# EAGLE design snatchfreezer_rev2 (EAGLE 7.1.0)
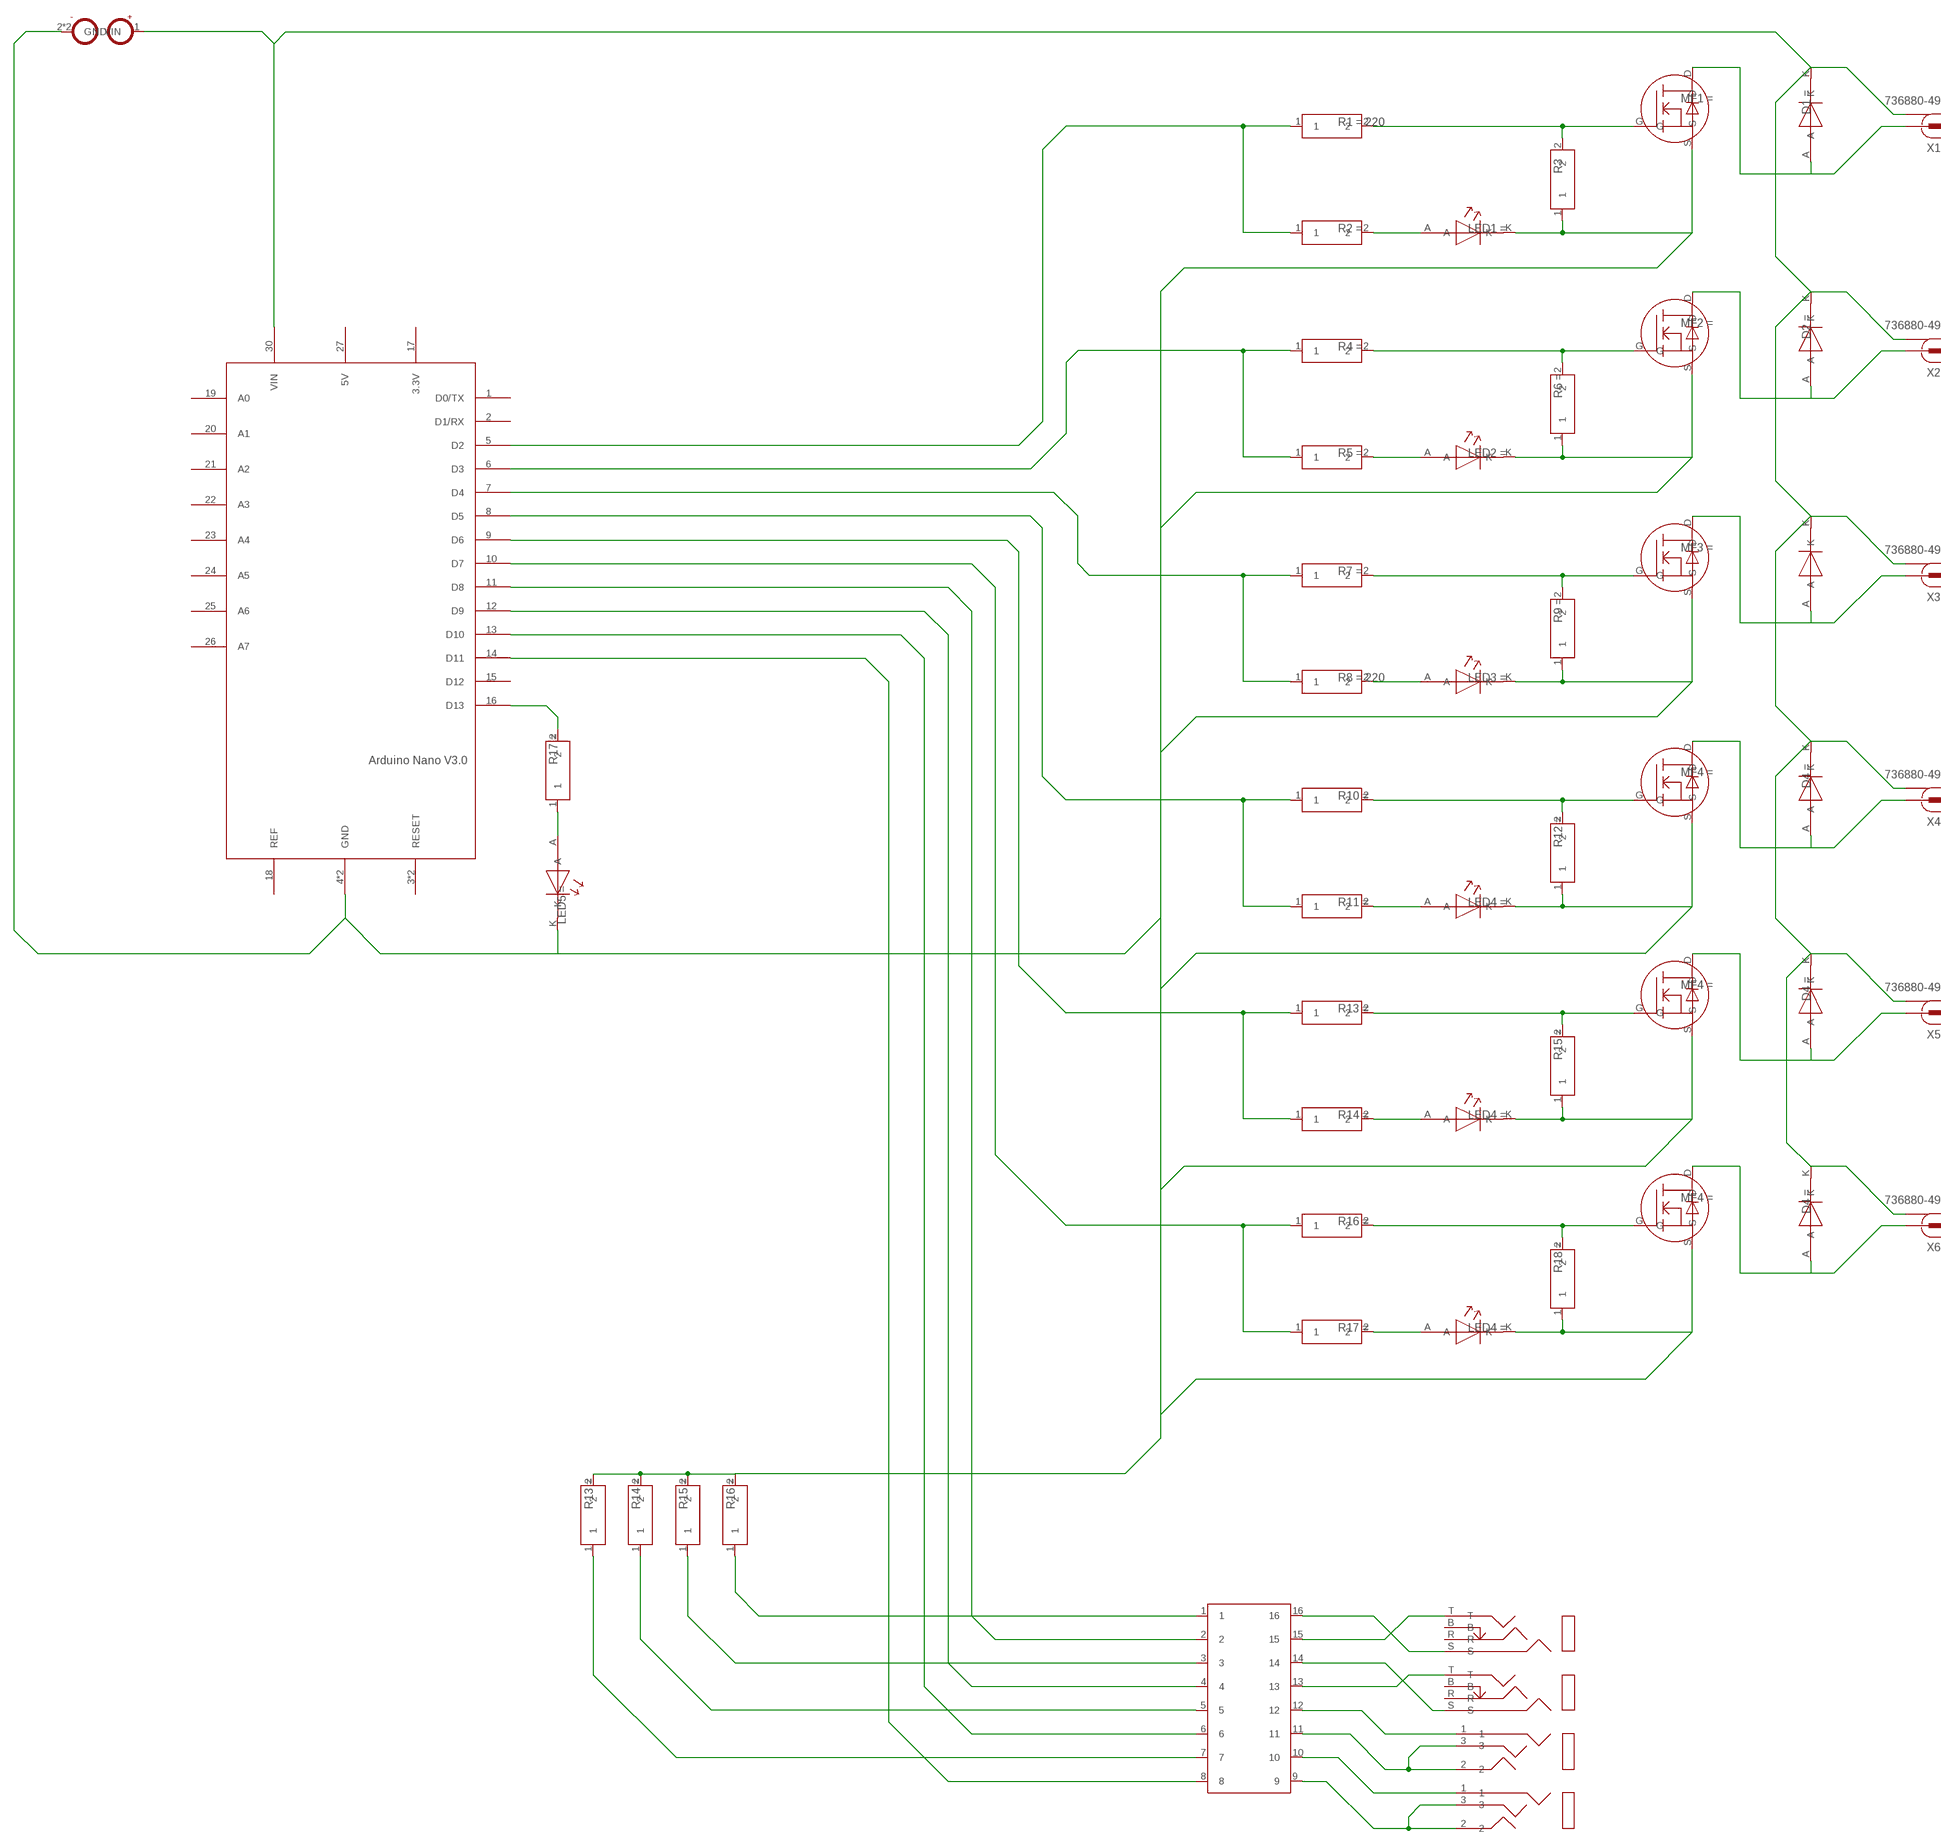
[diagram p0: schematic, sheet 1]

## Parts
R1  RESISTOR  [RESISTOR]
R2  RESISTOR  [RESISTOR]
R3  RESISTOR  [RESISTOR]
R4  RESISTOR  [RESISTOR]
R5  RESISTOR  [RESISTOR]
R6  RESISTOR  [RESISTOR]
R7  RESISTOR  [RESISTOR]
R8  RESISTOR  [RESISTOR]
R9  RESISTOR  [RESISTOR]
R10  RESISTOR  [RESISTOR]
R11  RESISTOR  [RESISTOR]
R12  RESISTOR  [RESISTOR]
R13  RESISTOR  [RESISTOR]
R14  RESISTOR  [RESISTOR]
R15  RESISTOR  [RESISTOR]
R16  RESISTOR  [RESISTOR]
R17  RESISTOR  [RESISTOR]
R18  RESISTOR  [RESISTOR]
U$1  ARDUINO_NANO30  [ARDUINO_NANO30]
U$2  IRLR8721  [IRLR8721]
U$3  IRLR8721  [IRLR8721]
U$4  IRLR8721  [IRLR8721]
U$5  LED3MM  [LED3MM]
U$6  PHONEJACK_35  [PHONEJACK_35]
U$7  PHONEJACK_35  [PHONEJACK_35]
U$8  IC-16  [IC-16]
U$9  RESISTOR  [RESISTOR]
U$10  LED3MM  [LED3MM]
U$11  LED3MM  [LED3MM]
U$12  DIODE  [DIODE]
U$13  DIODE  [DIODE]
U$14  DIODE  [DIODE]
U$16  IRLR8721  [IRLR8721]
U$17  LED3MM  [LED3MM]
U$20  IRLR8721  [IRLR8721]
U$21  DIODE  [DIODE]
U$22  LED3MM  [LED3MM]
U$23  LED3MM  [LED3MM]
U$24  DIODE  [DIODE]
U$28  IRLR8721  [IRLR8721]
U$30  RESISTOR  [RESISTOR]
U$31  LED3MM  [LED3MM]
U$32  DIODE  [DIODE]
U$36  POWER_CONNECT  [POWER_CONNECT]
U$37  RESISTOR  [RESISTOR]
U$38  RESISTOR  [RESISTOR]
U$39  RESISTOR  [RESISTOR]
U$40  PHONEJACK_25  [PHONEJACK_25]
U$41  PHONEJACK_25  [PHONEJACK_25]
X1  736880-49  [736880-49]
X2  736880-49  [736880-49]
X3  736880-49  [736880-49]
X4  736880-49  [736880-49]
X5  736880-49  [736880-49]
X6  736880-49  [736880-49]

## Nets
12V2: U$1.30(VIN) U$12.K U$13.K U$14.K U$21.K U$24.K U$32.K U$36.1(VIN) X1.GND X2.GND X3.GND X4.GND X5.GND X6.GND
GND2: R3.1 R6.1 R9.1 R12.1 R15.1 R18.1 U$1.4(GND) U$1.29(GND) U$2.S U$3.S U$4.S U$5.K U$10.K U$11.K U$16.S U$17.K U$20.S U$22.K U$23.K U$28.S U$30.2 U$31.K U$36.2(GND) U$36.3(GND) U$37.2 U$38.2 U$39.2
N$1: R1.2 R3.2 U$2.G
N$2: U$2.D U$12.A X1.SIGNAL
N$3: R2.2 U$11.A
N$4: U$7.S U$8.16
N$5: U$8.1 U$30.1
N$6: R1.1 R2.1 U$1.5(D2)
N$7: U$3.D U$13.A X2.SIGNAL
N$8: U$8.3 U$37.1
N$9: U$7.T U$8.15
N$10: R5.2 U$10.A
N$11: R4.2 R6.2 U$3.G
N$12: R4.1 R5.1 U$1.6(D3)
N$13: U$20.D U$24.A X3.SIGNAL
N$14: U$8.5 U$38.1
N$15: U$8.7 U$39.1
N$16: R8.2 U$23.A
N$17: R7.2 R9.2 U$20.G
N$18: R7.1 R8.1 U$1.7(D4)
N$19: U$28.D U$32.A X4.SIGNAL
N$20: U$1.11(D8) U$8.2
N$21: U$1.12(D9) U$8.4
N$22: R11.2 U$31.A
N$23: R10.2 R12.2 U$28.G
N$24: R10.1 R11.1 U$1.8(D5)
N$25: U$1.13(D10) U$8.6
N$26: U$1.14(D11) U$8.8
N$27: U$6.T U$8.13
N$28: U$6.S U$8.14
N$29: U$4.D U$14.A X5.SIGNAL
N$30: R14.2 U$5.A
N$31: U$8.12 U$40.1
N$32: U$8.11 U$40.2 U$40.3
N$33: U$8.10 U$41.1
N$34: U$8.9 U$41.2 U$41.3
N$35: U$1.16(D13) U$9.2
N$36: U$9.1 U$22.A
N$37: R13.2 R15.2 U$4.G
N$38: R13.1 R14.1 U$1.9(D6)
N$39: U$16.D U$21.A X6.SIGNAL
N$40: R17.2 U$17.A
N$41: R16.2 R18.2 U$16.G
N$42: R16.1 R17.1 U$1.10(D7)
Unconnected: U$1.1(D0/TX) U$1.2(D1/RX) U$1.3(RESET) U$1.15(D12) U$1.17(3.3V) U$1.18(REF) U$1.19(A0) U$1.20(A1) U$1.21(A2) U$1.22(A3) U$1.23(A4) U$1.24(A5) U$1.25(A6) U$1.26(A7) U$1.27(5V) U$1.28(RESET) U$6.B U$6.R U$7.B U$7.R

## Library data of the parts
R1 = drazil:RESISTOR; R1: 220
R2-R7 R9-R18 U$9 U$30 U$37-U$39 = drazil:RESISTOR
R8 = drazil:RESISTOR; R8: 220
U$1 = drazil:ARDUINO_NANO30
U$2-U$4 U$16 U$20 U$28 = drazil:IRLR8721
U$5 U$10 U$11 U$17 U$22 U$23 U$31 = drazil:LED3MM
U$6 U$7 = drazil:PHONEJACK_35
U$8 = drazil:IC-16
U$12-U$14 U$21 U$24 U$32 = drazil:DIODE
U$36 = drazil:POWER_CONNECT
U$40 U$41 = drazil:PHONEJACK_25
X1-X6 = drazil:736880-49: Cinch Connector ( RCA Jack ) Cinch-Einbaukupplung 90º 72345 Vernickelt BKL Electronic Source: Conrad <http://www.conrad.de/ce/de/product/736880>

## Board
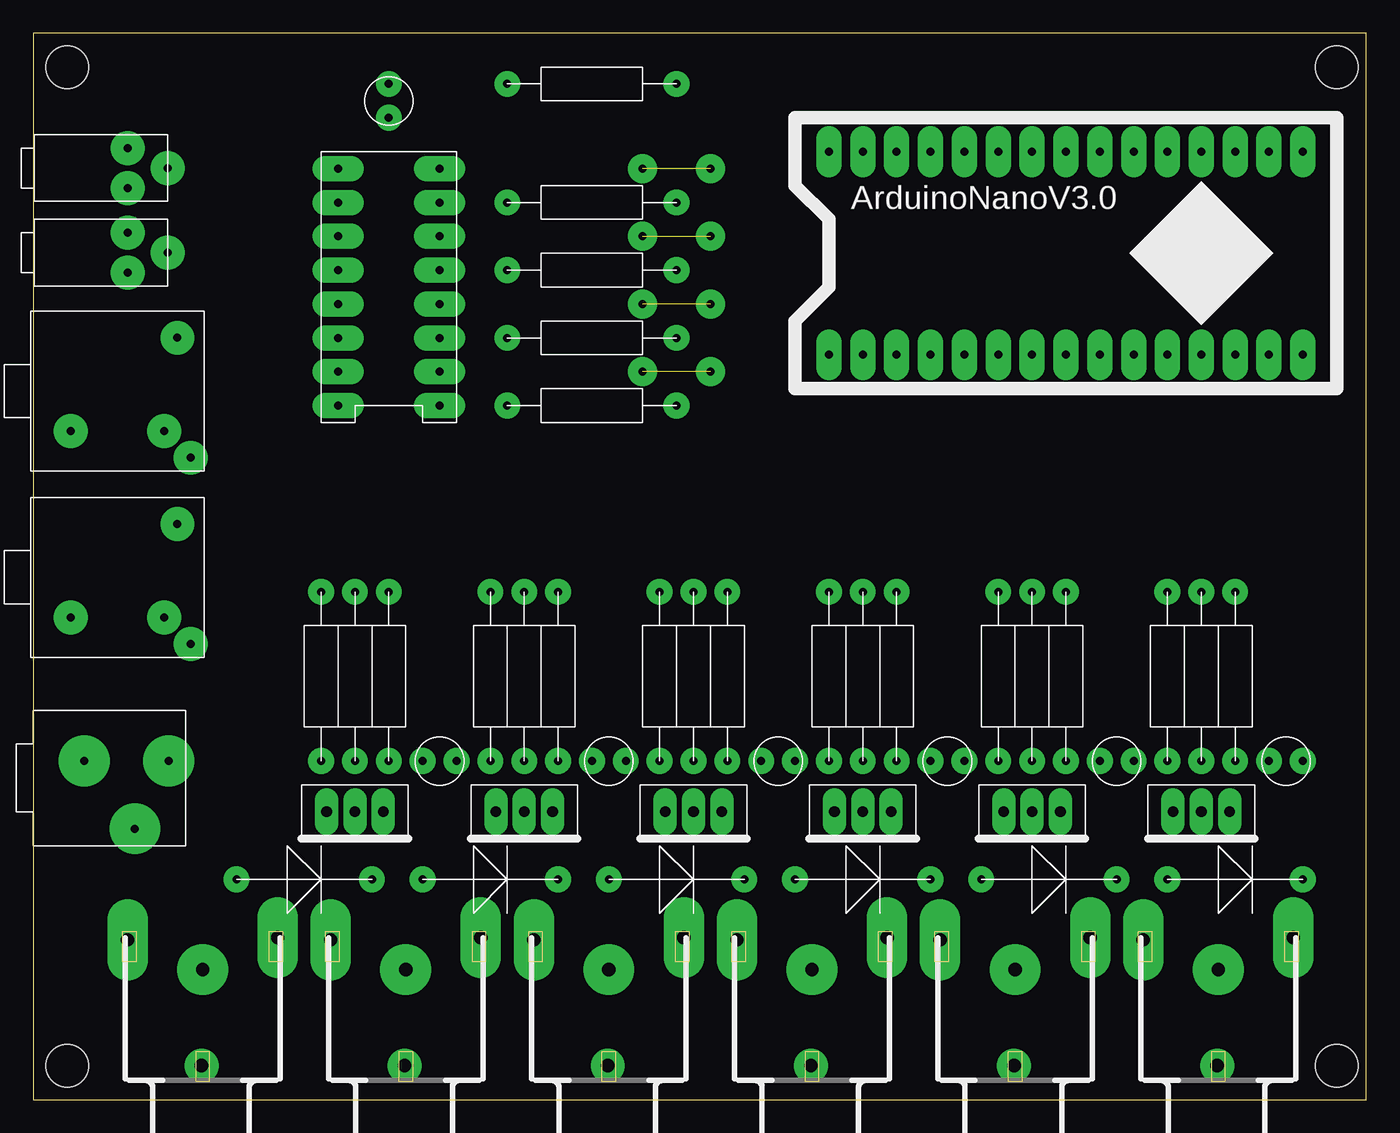
[diagram p1: board, top side]
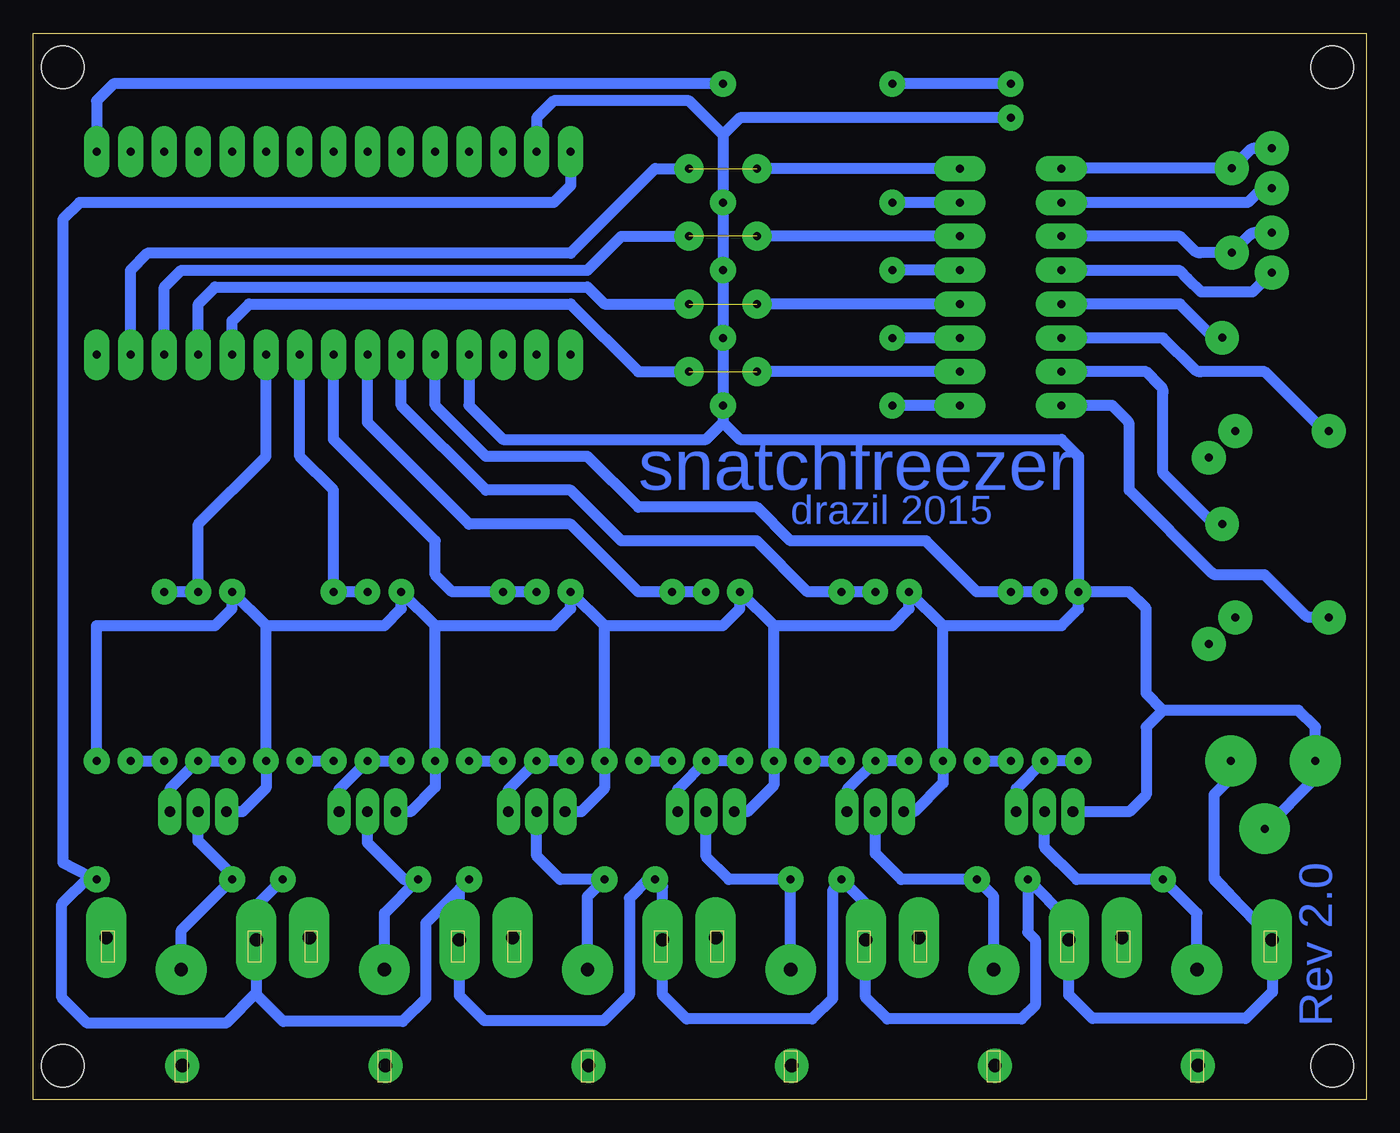
[diagram p2: board, bottom side, seen from below]

Size 100 x 80 mm. Coordinates in mm from the lower left corner, seen from the top.
Outline: 100,0 100,80 0,80 0,0 100,0
Copper layers (1*16): Top 0.035mm / dielectric 1.5mm / Bottom 0.035mm
Design rules "default": minimum track width 10mil, minimum drill 24mil, track to track 8mil, track to pad 8mil, pad to pad 8mil, via to via 8mil, smd to smd 8mil, copper to edge 40mil, drill to drill 8mil, minimum pad ring 10mil, minimum via ring 8mil, stop-mask expansion 4mil, vias tented up to drill 0mil, thermal gap 10mil
Holes 3.2 mm at 2.54,2.54 2.54,77.47 97.79,2.54 97.79,77.47

### Footprints (pad centres in the part's own frame; a part is rotated, then mirrored left to right if it is on the bottom)
RESISTOR = drill 0.6 pad 1.93: 1 -7.62,0; 2 5.08,0
ARDUINO_NANO30 = drill 0.6 pad 1.93 long: 1 -7.62,17.78; 2 -7.62,15.24; 3 -7.62,12.7; 4 -7.62,10.16; 5 -7.62,7.62; 6 -7.62,5.08; 7 -7.62,2.54; 8 -7.62,0; 9 -7.62,-2.54; 10 -7.62,-5.08; 11 -7.62,-7.62; 12 -7.62,-10.16; 13 -7.62,-12.7; 14 -7.62,-15.24; 15 -7.62,-17.78; 16 7.62,-17.78; 17 7.62,-15.24; 18 7.62,-12.7; 19 7.62,-10.16; 20 7.62,-7.62; 21 7.62,-5.08; 22 7.62,-2.54; 23 7.62,0; 24 7.62,2.54; 25 7.62,5.08; 26 7.62,7.62; 27 7.62,10.16; 28 7.62,12.7; 29 7.62,15.24; 30 7.62,17.78
IRLR8721 = drill 0.8 pad 1.778 long: D 0,0; G 0,-2.127; S 0,2.127
LED3MM = drill 0.6 pad 1.93: A -2.54,0; K 0,0
PHONEJACK_35 = drill 0.6 pad 2.54: B -3.19,-3.46; R -5.19,-5.46; S -3.19,3.54; T 3.81,-4.46
IC-16 = drill 0.6 pad 1.93 long: 1 -3.81,8.89; 2 -3.81,6.35; 3 -3.81,3.81; 4 -3.81,1.27; 5 -3.81,-1.27; 6 -3.81,-3.81; 7 -3.81,-6.35; 8 -3.81,-8.89; 9 3.81,-8.89; 10 3.81,-6.35; 11 3.81,-3.81; 12 3.81,-1.27; 13 3.81,1.27; 14 3.81,3.81; 15 3.81,6.35; 16 3.81,8.89
DIODE = drill 0.6 pad 1.93: A -5.08,0; K 5.08,0
POWER_CONNECT = drill 0.6 pad 3.81: 1 0,3.81; 2 0,-2.54; 3 5.08,1.27
PHONEJACK_25 = drill 0.6 pad 2.54: 1 -1.46,-2; 2 0.04,-5; 3 1.54,-2
736880-49 = drill 1 pad 3.048 long: GND 5.63,5.63; P$5 5.8,-5.63 | drill 1 pad 2.54: P$1 -3.81,0.08 | drill 1 pad 3.81: SIGNAL 3.4,0

### Placement (x,y rotation side)
R1  24.13,30.48 270 top
R2  26.67,30.48 270 top
R3  21.59,30.48 270 top
R4  36.83,30.48 270 top
R5  39.37,30.48 270 top
R6  34.29,30.48 270 top
R7  49.53,30.48 270 top
R8  52.07,30.48 270 top
R9  46.99,30.48 270 top
R10  62.23,30.48 270 top
R11  64.77,30.48 270 top
R12  59.69,30.48 270 top
R13  74.93,30.48 270 top
R14  77.47,30.48 270 top
R15  72.39,30.48 270 top
R16  87.63,30.48 270 top
R17  90.17,30.48 270 top
R18  85.09,30.48 270 top
U$1  77.47,63.5 90 top
U$2  24.13,21.59 90 top
U$3  36.83,21.59 90 top
U$4  74.93,21.59 90 top
U$5  82.55,25.4 0 top
U$6  6.35,53.34 90 top
U$7  6.35,39.37 90 top
U$8  26.67,60.96 180 top
U$9  43.18,76.2 0 top
U$10  44.45,25.4 0 top
U$11  31.75,25.4 0 top
U$12  20.32,16.51 0 top
U$13  34.29,16.51 0 top
U$14  76.2,16.51 0 top
U$16  87.63,21.59 90 top
U$17  95.25,25.4 0 top
U$20  49.53,21.59 90 top
U$21  90.17,16.51 0 top
U$22  26.67,73.66 270 top
U$23  57.15,25.4 0 top
U$24  48.26,16.51 0 top
U$28  62.23,21.59 90 top
U$30  43.18,52.07 0 top
U$31  69.85,25.4 0 top
U$32  62.23,16.51 0 top
U$36  6.35,25.4 270 top
U$37  43.18,57.15 0 top
U$38  43.18,62.23 0 top
U$39  43.18,67.31 0 top
U$40  5.08,63.5 90 top
U$41  5.08,69.85 90 top
X1  12.7,6.35 90 top
X2  27.94,6.35 90 top
X3  43.18,6.35 90 top
X4  58.42,6.35 90 top
X5  73.66,6.35 90 top
X6  88.9,6.35 90 top

### Tracks (layer width: path | path; a pad name or v marks a point on that pad's centre or on a via)
12V2
  Bottom 0.813: U$36.1 10.16,24.13 11.43,22.86 11.43,16.68 | 11.43,16.68 X1.GND | U$1.30 59.69,68.58 60.96,67.31 96.52,67.31 97.79,66.04 97.79,17.78 95.75,16.76 | 95.75,16.76 U$21.K | 11.43,16.68 11.43,16.52 7.03,12.12 7.03,8.08 9.03,6.08 20.54,6.08 22.32,7.86 22.32,11.96 X2.GND 22.31,13.42 U$12.K 25.4,12.55 24.84,11.99 24.84,7.06 25.85,6.04 35.94,6.04 37.56,7.67 X3.GND 37.55,14.69 U$13.K 39.37,16.35 40.04,15.68 40.04,7.57 41.56,6.04 50.98,6.04 52.79,7.86 X4.GND | X4.GND 52.79,15.96 U$24.K 53.87,16.51 55.27,15.11 55.27,7.86 57.21,5.92 66.15,5.92 68.02,7.79 X5.GND 68.03,15.77 | U$32.K 68.03,15.79 68.03,15.77 | X6.GND 83.27,14.52 U$14.K | X4.GND | 68.03,15.77 70.57,13.23 70.57,7.57 72.28,5.85 81.25,5.85 83.26,7.86 83.26,11.97 X6.GND | X6.GND 83.27,8 85.55,5.72 95.94,5.72 97.85,7.63 97.85,14.66 95.75,16.76
GND2
  Bottom 0.813: U$22.K 46.99,73.66 48.26,72.39 | 48.26,72.39 U$39.2 U$38.2 U$37.2 U$30.2 48.26,50.8 | 48.26,50.8 46.99,49.53 22.86,49.53 21.59,48.26 R3.1 | 48.26,72.39 50.8,74.93 60.96,74.93 62.23,73.66 U$1.29 | U$1.4 67.31,52.07 64.77,49.53 49.53,49.53 48.26,50.8 | 15.24,29.21 5.08,29.21 3.81,27.94 U$36.2 3.81,24.13 U$36.3 | 15.24,29.21 16.51,27.94 16.51,22.86 17.78,21.59 U$2.S | 15.24,29.21 16.51,30.48 16.51,36.83 17.78,38.1 R3.1 | 31.75,35.56 R6.1 34.29,36.83 35.56,35.56 44.45,35.56 | 44.45,35.56 R9.1 46.99,36.83 48.26,35.56 57.15,35.56 | 57.15,35.56 R12.1 59.69,36.83 60.96,35.56 69.85,35.56 | 69.85,35.56 R15.1 72.39,36.83 73.66,35.56 82.55,35.56 | 82.55,35.56 R18.1 85.09,36.83 86.36,35.56 95.25,35.56 U$17.K | 31.75,35.56 U$11.K 31.75,23.74 33.9,21.6 U$3.S | 31.75,35.56 22.86,35.56 21.59,36.83 R3.1 | 44.45,35.56 U$10.K 44.45,23.59 46.44,21.6 U$20.S | 57.15,35.56 U$23.K 57.15,23.34 58.89,21.6 U$28.S | 69.85,35.56 U$31.K 69.85,23.45 71.7,21.6 U$4.S | 82.55,35.56 U$5.K 82.55,23.38 84.33,21.6 U$16.S
N$1
  Bottom 0.813: R3.2 R1.2 24.18,25.4 26.25,23.32 U$2.G
N$2
  Bottom 0.813: U$2.D 24.14,18.93 21.72,16.51 U$12.A 12.7,13.97 X1.SIGNAL
N$3
  Bottom 0.813: U$11.A R2.2
N$4
  Bottom 0.813: U$7.S 4.17,36.18 arc45 4.62,36.37 7.62,39.37 11.17,39.37 arc45 11.62,39.56 17.78,45.72 17.78,50.54 arc-45 17.97,50.99 19.05,52.07 U$8.16
N$5
  Bottom 0.813: U$8.1 U$30.1
N$6
  Bottom 0.813: R2.1 R1.1 29.21,38.1 33.02,41.91 43.18,41.91 45.72,44.45 54.61,44.45 58.42,48.26 66.04,48.26 69.85,52.07 U$1.5
N$7
  Bottom 0.813: U$3.D 36.83,18.46 34.88,16.51 U$13.A 27.94,15.24 X2.SIGNAL
N$8
  Bottom 0.813: U$8.3 U$37.1
N$9
  Bottom 0.813: U$7.T 11.17,43.18 arc45 11.62,43.37 15.24,46.99 15.24,53.08 arc-45 15.43,53.53 16.51,54.61 U$8.15
N$10
  Bottom 0.813: U$10.A R5.2
N$11
  Bottom 0.813: R6.2 R4.2 36.83,25.38 38.95,23.25 U$3.G
N$12
  Bottom 0.813: R5.1 R4.1 41.91,38.1 45.72,41.91 55.88,41.91 59.69,45.72 66.04,45.72 72.39,52.07 U$1.6
N$13
  Bottom 0.813: U$20.D 49.53,18.22 47.82,16.51 U$24.A X3.SIGNAL
N$14
  Bottom 0.813: U$8.5 U$38.1
N$15
  Bottom 0.813: U$8.7 U$39.1
N$16
  Bottom 0.813: U$23.A R8.2
N$17
  Bottom 0.813: R9.2 R7.2 51.65,23.28 51.65,21.6 U$20.G
N$18
  Bottom 0.813: R8.1 R7.1 54.61,38.1 59.69,43.18 67.31,43.18 74.93,50.8 U$1.7
N$19
  Bottom 0.813: U$28.D 62.23,18.26 60.47,16.51 U$32.A 58.42,15.24 X4.SIGNAL
N$20  (via drill 0.6 pad 2.18)  (1 unrouted)
  Bottom 0.813: U$8.2 v45.72,54.61 | U$1.11 85.09,58.42 83.82,59.69 59.69,59.69 54.61,54.61 v50.8,54.61
N$21  (via drill 0.6 pad 2.18)  (1 unrouted)
  Bottom 0.813: U$8.4 v45.72,59.69 | U$1.12 87.63,59.69 86.36,60.96 58.42,60.96 57.15,59.69 v50.8,59.69
N$22
  Bottom 0.813: U$31.A R11.2
N$23
  Bottom 0.813: R12.2 R10.2 62.23,25.37 64.37,23.23 U$28.G
N$24
  Bottom 0.813: R11.1 R10.1 68.58,38.1 69.85,39.37 69.85,41.91 77.47,49.53 U$1.8
N$25  (via drill 0.6 pad 2.18)  (1 unrouted)
  Bottom 0.813: U$1.13 90.17,60.96 88.9,62.23 58.42,62.23 55.88,64.77 v50.8,64.77 | U$8.6 v45.72,64.77
N$26  (via drill 0.6 pad 2.18)  (1 unrouted)
  Bottom 0.813: U$8.8 v45.72,69.85 | U$1.14 92.71,62.23 91.44,63.5 59.69,63.5 53.34,69.85 v50.8,69.85
N$27
  Bottom 0.813: U$6.T 11.17,57.15 arc45 11.62,57.34 13.97,59.69 U$8.13
N$28
  Bottom 0.813: U$6.S 2.9,50.15 arc45 3.35,50.34 7.62,54.61 12.44,54.61 arc45 12.89,54.8 15.24,57.15 U$8.14
N$29
  Bottom 0.813: U$4.D 74.92,19.26 72.17,16.51 U$14.A 73.66,13.97 X5.SIGNAL
N$30
  Bottom 0.813: U$5.A R14.2
N$31
  Bottom 0.813: U$8.12 14.03,62.23 13.4,61.61 | 13.4,61.61 | 13.4,61.61 12.4,60.6 8.52,60.6 U$40.1
N$32
  Bottom 0.813: U$40.3 8.32,65.04 arc-45 8.77,64.85 U$40.2 12.48,63.54 arc45 12.93,63.73 13.97,64.77 U$8.11
N$33
  Bottom 0.813: U$41.1 7.55,68.39 arc-45 8,68.2 8.89,67.31 U$8.10
N$34
  Bottom 0.813: U$41.3 8.32,71.39 arc-45 8.77,71.2 U$41.2 22.76,69.89 arc-45 U$8.9
N$35
  Bottom 0.813: U$9.2 93.98,76.2 95.25,74.93 U$1.16
N$36
  Bottom 0.813: U$22.A U$9.1
N$37
  Bottom 0.813: R15.2 R13.2 74.93,25.39 77.06,23.25 U$4.G
N$38
  Bottom 0.813: R13.1 R14.1 77.47,45.72 80.01,48.26 U$1.9
N$39
  Bottom 0.813: U$16.D 87.64,21.58 87.64,19.39 85.09,16.84 U$21.A 88.9,12.7 X6.SIGNAL
N$40
  Bottom 0.813: U$17.A R17.2
N$41
  Bottom 0.813: R18.2 R16.2 87.66,25.4 89.76,23.3 U$16.G
N$42
  Bottom 0.813: R17.1 R16.1 87.63,43.18 82.55,48.26 U$1.10

### Text on the board
Bottom: snatchfreezer | drazil 2015 | Rev 2.0